# Altium schematic sheet Sensors.SchDoc: Sensors
size 431 x 279 mm; Date: 06/01/2025; ApprovedBy: John Watson; CheckedBy: John Watson; Author: Mehdi Kacem; DrawnBy: Mehdi Kacem; Engineer: Mehdi Kacem; DocumentNumber: BMC-125-5321; Revision: A; SheetNumber: 2; SheetTotal: 6
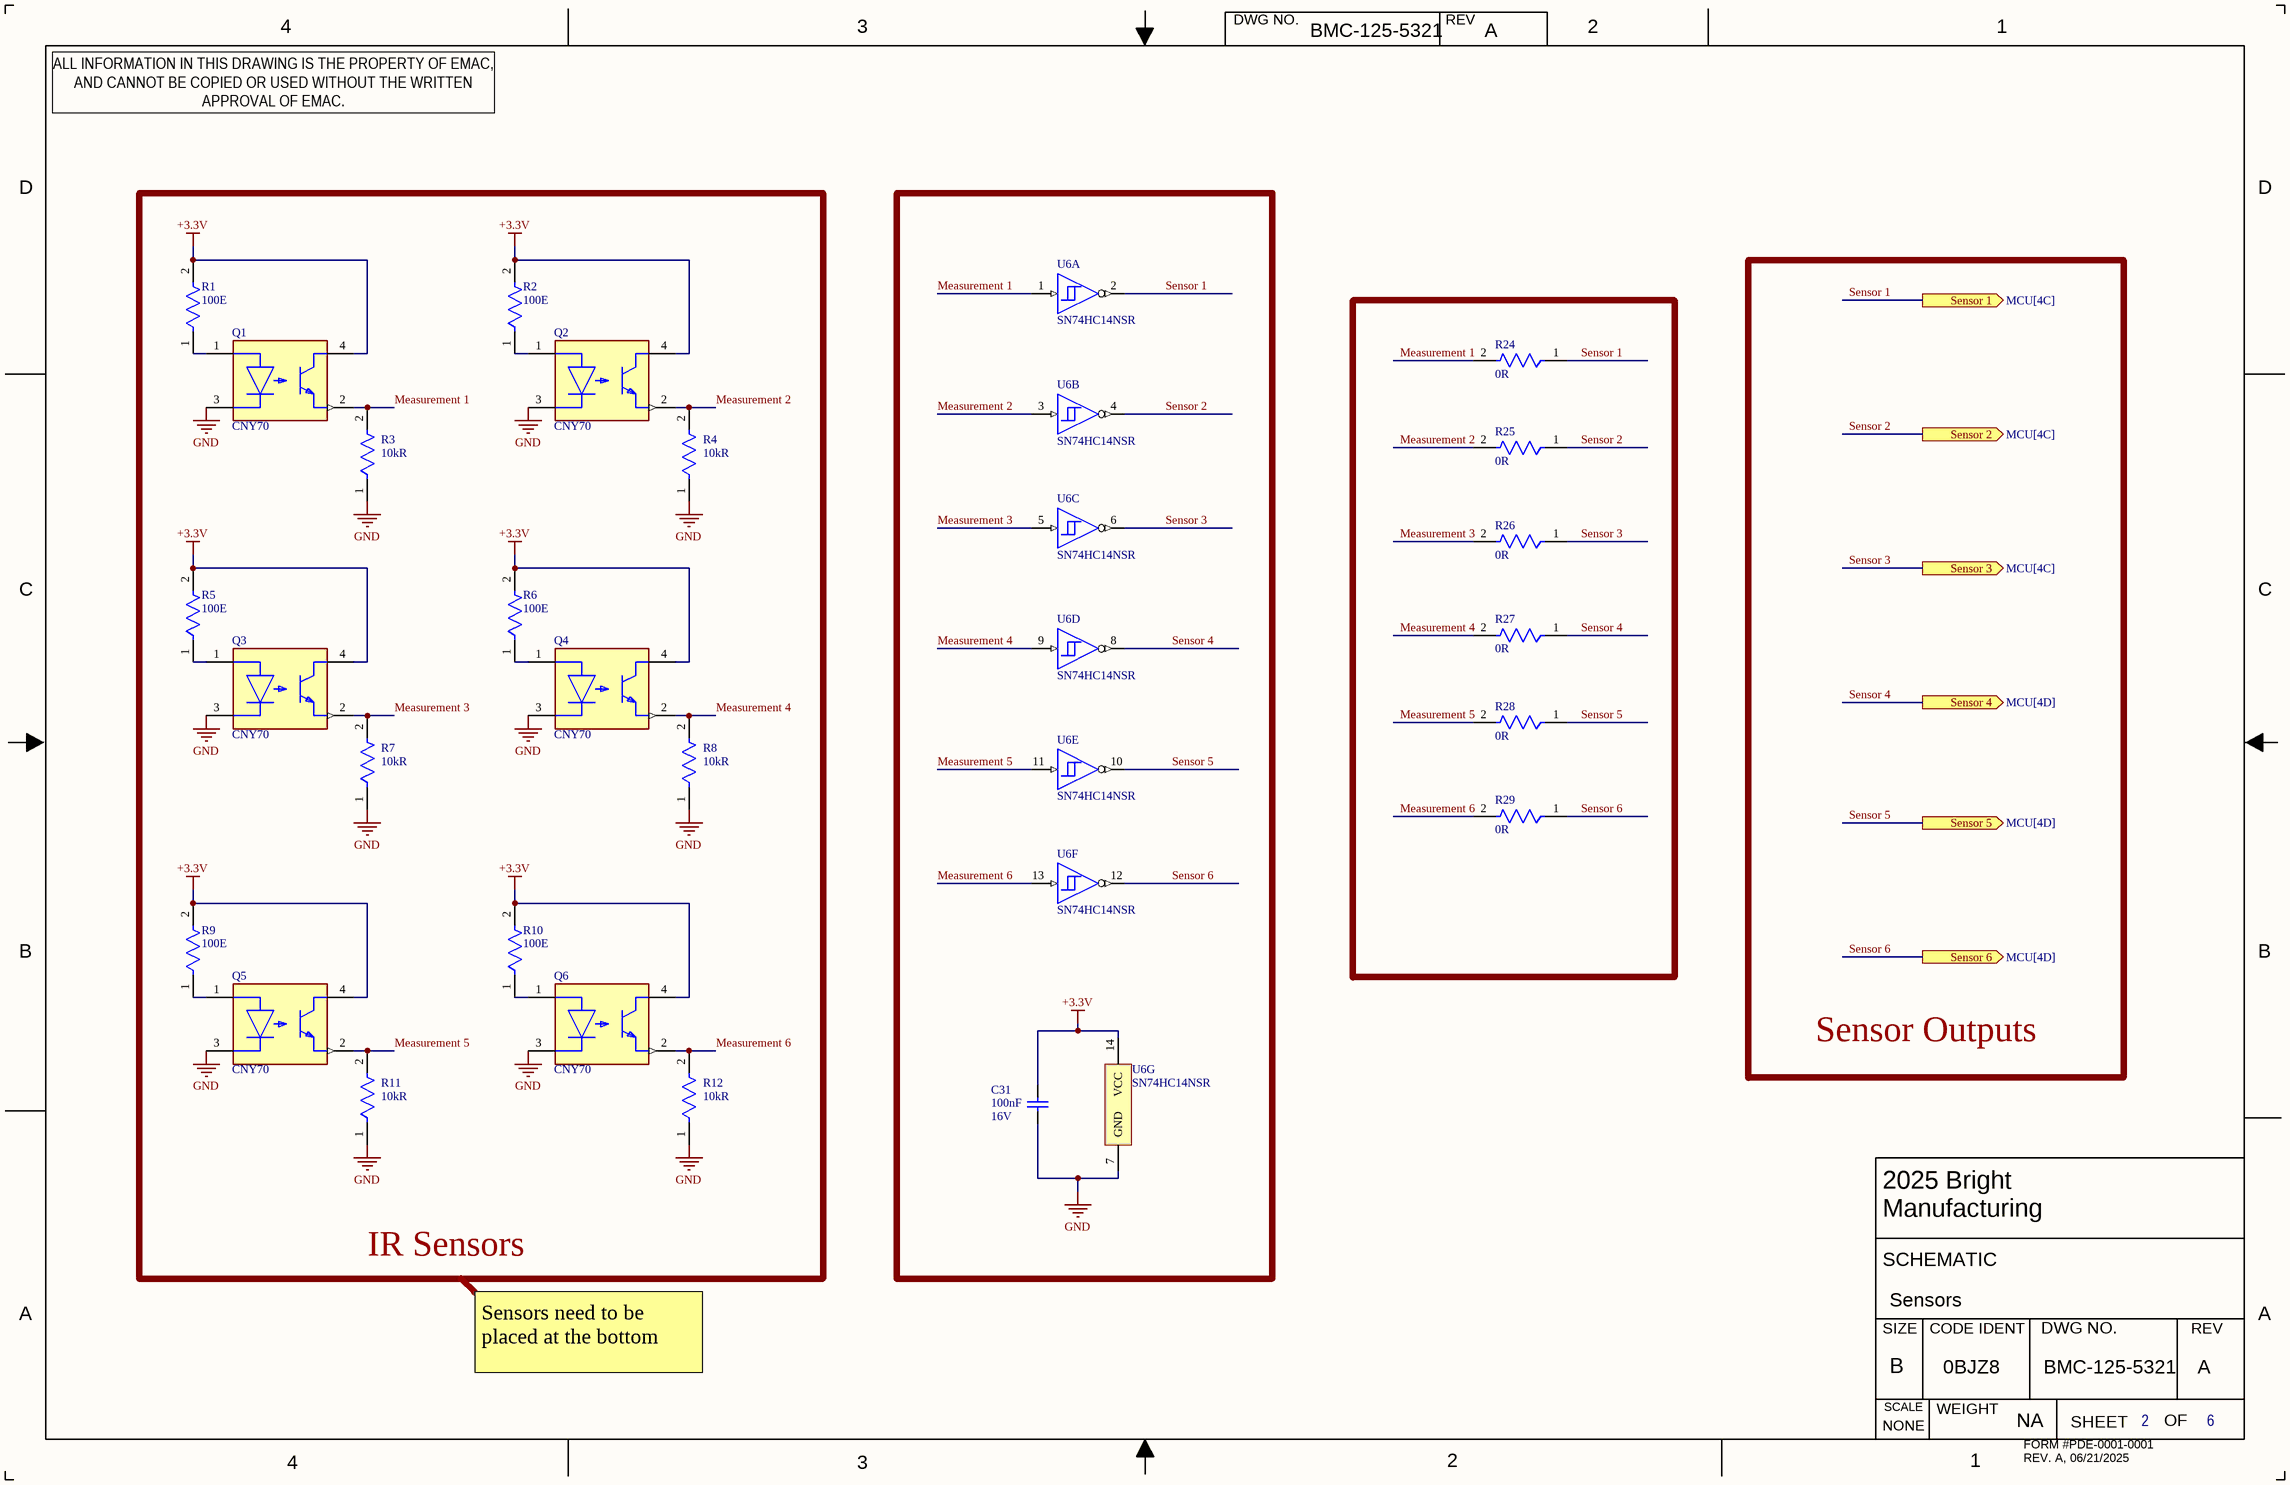
[diagram p0: Sensors.SchDoc]

## Parts
C31  value 100nF  Rated DC Voltage (URdc): 16V  [CAPC1608X90X35LL15T15]  (hidden comment: 0.1uF 16V 0603)
Q1  CNY70  [FP-6_544-5062_01-4-MFG]
Q2  CNY70  [FP-6_544-5062_01-4-MFG]
Q3  CNY70  [FP-6_544-5062_01-4-MFG]
Q4  CNY70  [FP-6_544-5062_01-4-MFG]
Q5  CNY70  [FP-6_544-5062_01-4-MFG]
Q6  CNY70  [FP-6_544-5062_01-4-MFG]
R1  100E  [FP-RT0603-MFG]
R2  100E  [FP-RT0603-MFG]
R3  value 10kR  [RESC1608X55X25ML10T15]  (hidden comment: 10KOhm 0603)
R4  value 10kR  [RESC1608X55X25ML10T15]  (hidden comment: 10KOhm 0603)
R5  100E  [FP-RT0603-MFG]
R6  100E  [FP-RT0603-MFG]
R7  value 10kR  [RESC1608X55X25ML10T15]  (hidden comment: 10KOhm 0603)
R8  value 10kR  [RESC1608X55X25ML10T15]  (hidden comment: 10KOhm 0603)
R9  100E  [FP-RT0603-MFG]
R10  100E  [FP-RT0603-MFG]
R11  value 10kR  [RESC1608X55X25ML10T15]  (hidden comment: 10KOhm 0603)
R12  value 10kR  [RESC1608X55X25ML10T15]  (hidden comment: 10KOhm 0603)
R24  0R  [FP-RC0603-MFG]
R25  0R  [FP-RC0603-MFG]
R26  0R  [FP-RC0603-MFG]
R27  0R  [FP-RC0603-MFG]
R28  0R  [FP-RC0603-MFG]
R29  0R  [FP-RC0603-MFG]
U6  SN74HC14NSR  [NS0014A_N]  (parts A,B,C,D,E,F,G of 7)

## Blocks framed on the sheet
IR Sensors: Q1-Q6 R1-R12

## Ports
Sensor 1 (out, see MCU[4C]), Sensor 2 (out, see MCU[4C]), Sensor 3 (out, see MCU[4C]), Sensor 4 (out, see MCU[4D]), Sensor 5 (out, see MCU[4D]), Sensor 6 (out, see MCU[4D])

## Nets
+3.3V: C31.2 Q1.4(C) Q2.4(C) Q3.4(C) Q4.4(C) Q5.4(C) Q6.4(C) R1.2 R2.2 R5.2 R6.2 R9.2 R10.2 U6.14(VCC)
GND: C31.1 Q1.3(C) Q2.3(C) Q3.3(C) Q4.3(C) Q5.3(C) Q6.3(C) R3.1 R4.1 R7.1 R8.1 R11.1 R12.1 U6.7(GND)
Measurement 1: Q1.2(E) R3.2 R24.2 U6.1(1A)
Measurement 2: Q2.2(E) R4.2 R25.2 U6.3(2A)
Measurement 3: Q3.2(E) R7.2 R26.2 U6.5(3A)
Measurement 4: Q4.2(E) R8.2 R27.2 U6.9(4A)
Measurement 5: Q5.2(E) R11.2 R28.2 U6.11(5A)
Measurement 6: Q6.2(E) R12.2 R29.2 U6.13(6A)
Sensor 1: R24.1 U6.2(~{1Y}) ; port Sensor 1
Sensor 2: R25.1 U6.4(~{2Y}) ; port Sensor 2
Sensor 3: R26.1 U6.6(~{3Y}) ; port Sensor 3
Sensor 4: R27.1 U6.8(~{4Y}) ; port Sensor 4
Sensor 5: R28.1 U6.10(~{5Y}) ; port Sensor 5
Sensor 6: R29.1 U6.12(~{6Y}) ; port Sensor 6
NetQ1_1: Q1.1(A) R1.1
NetQ2_1: Q2.1(A) R2.1
NetQ3_1: Q3.1(A) R5.1
NetQ4_1: Q4.1(A) R6.1
NetQ5_1: Q5.1(A) R9.1
NetQ6_1: Q6.1(A) R10.1

## Notes on the sheet
- Sensor Outputs
- Sensors need to be placed at the bottom
- 4
- 3
- DWG NO.
- REV
- 2
- 1
- ALL INFORMATION IN THIS DRAWING IS THE PROPERTY OF EMAC, AND CANNOT BE COPIED OR USED WITHOUT THE WRITTEN APPROVAL OF EMAC.
- D
- C
- B
- 2025 Bright Manufacturing Challenge
- SCHEMATIC
- A
- SIZE
- CODE IDENT
- 0BJZ8
- NONE
- SCALE
- WEIGHT
- NA
- SHEET
- OF
- REV. A, 06/21/2025
- FORM #PDE-0001-0001

## Library data of the parts
C31 = CMP-00000-2: Ceramic Capacitor, Multilayer, Ceramic, 16V, 10% +Tol, 10% -Tol, X7R, 15% TC, 0.1uF, Surface Mount, 0603; Multilayer: Yes; Reference Standard: AEC-Q200; Height: 0.9mm; Capacitor Type: Ceramic; Case/Package: 0603; Dielectric Material: Ceramic; JESD-609 Code: e3; Length: 1.6mm; Max Operating Temperature: 125°C; Min Operating Temperature: -55°C; Mounting Technology: Surface Mount; Package Shape: Rectangular; Package Style: SMTMeter; Packaging: Tape and Reel; Pins: 2; Reach SVHC Compliant: Yes; RoHS Compliant: Yes; Temperature Characteristics Code: X7R; Terminal Finish: Nickel; Termination: Wraparound; Tolerance  (fill in as +-): 10%; Tolerance (fill in as +-): 10%; Width: 0.81mm
Q1-Q6 = CMP-00014-1: Diffuse Photoelectric Sensor, 0mm Min, 5mm Max, 0.30-1mA, 1-Channel, Square, Through Hole Mount; Body Breadth: 7mm; Body Height: 6mm; Gap Size: 7.6mm; Max Output Voltage: 32V; Max Supply Voltage: 1.6V; Min Supply Voltage: 1.25V; Number of Channels: 1; Operating Current-Max: 50mA; Output Circuit Type: TRANSISTOR; Output Type: Analog Current; Sensor Type: LINEAR POSITION SENSOR,PHOTOELECTRIC,DIFFUSE; VCEsat-Max: 300mV; Body Length or Diameter: 7mm; Max Operating Temperature: 85°C; Measurement Range-Max (mm): 5mm; Measurement Range-Min (mm): 0mm; Min Operating Temperature: -40°C; Mounting Technology: Through Hole; Output Range: 0.30-1mA; Package Shape/Style: Square; Reach SVHC Compliant: Yes; RoHS Compliant: Yes; Termination: Solder
R1 R2 R5 R6 R9 R10 = CMP-2000-04607-2: RES SMD 100 OHM 0.5% 1/10W 0603; Manufacturer Part Number: RT0603DRE07100RL; Manufacturer: Yageo; Voltage Rating: 75V; Power Rating: 0.1W; Tolerance: 0.005; Value: 100Ω; Temperature Coefficient: 50 ppm/°C; ComponentLink2URL: http://www.yageo.com/documents/recent/PYu-RT_1-to-0.01_RoHS_L_9.pdf; ComponentLink2Description: Datasheet; Composition: Thin Film; Temperature Range High: +155°C; Height: 0.55mm; RoHS: TRUE; Octopart: https://octopart.com/rt0603dre07100rl-yageo-1441481; Temperature: -55°C to +155°C; Temperature Range Low: -55°C; Digikey Description: RES SMD 100 OHM 0.5% 1/10W 0603; Ipc Land Pattern Name: RESC16080X45; Device Class L1: Passive Components; Automotive: No; Lead Free: Yes; Device Class L2: Resistors; Package: RT0603; Category: Res; Footprint Url: http://www.yageo.com/exep/pages/download/literatures/PYu-R_Mount_10.pdf; Resistance: 100Ω; Device Class L3: Chip SMD Resistors; Series: RT
R3 R4 R7 R8 R11 R12 = CMP-00018-1: Fixed Resistor, Metal Glaze/thick Film, 0.1W, 10000ohm, 75V, 5% +/-Tol, 100ppm/Cel, Surface Mount, 0603; Additional Feature: LASER TRIMMABLE; Package Height: 0.45mm; Package Length: 1.6mm; Package Width: 0.8mm; Power: 100mW; Rated Temperature: 70°C; Temperature Coefficient (ppm/Cel): 100; Packaging: Tape and Reel; Tolerance: 5%; Case/Package: 0603; Construction: Chip; JESD-609 Code: e3; Max Operating Temperature: 155°C; Min Operating Temperature: -55°C; Mounting Technology: Surface Mount; Package Shape: Rectangular; Pins: 2; Reach SVHC Compliant: Yes; Resistor Type: FIXED RESISTOR; RoHS Compliant: Yes; Technology: METAL GLAZE/THICK FILM; Terminal Finish: Nickel; Termination: Wraparound; Working Voltage: 75V
R24-R29 = CMP-2000-06925-2: RES SMD 0 OHM JUMPER 1/10W 0603; Manufacturer: Yageo; Manufacturer Part Number: RC0603FR-070RL; Tolerance: 1%; Value: 0Ω; Power Rating: 0.1W; Voltage Rating: 75V; Composition: Thick Film; Temperature Range Low: -55°C; Ipc Land Pattern Name: RESC16080X45; Lead Free: Yes; Digikey Description: RES SMD 0 OHM JUMPER 1/10W 0603; Height: 0.55mm; Automotive: No; Device Class L3: Chip SMD Resistors; Device Class L1: Passive Components; Device Class L2: Resistors; Footprint Url: http://www.yageo.com/exep/pages/download/literatures/PYu-R_Mount_10.pdf; Category: Res; Mouser Description: RC Series 0603 0.1 W 0 O Jumper Surface Mount Thick Film Chip Resistor; Resistance: 0Ω; ComponentLink2URL: http://www.yageo.com/documents/recent/PYu-RC_Group_51_RoHS_L_10.pdf; Series: RC_L; ComponentLink2Description: Datasheet; RoHS: TRUE; Temperature: -55°C to +155°C; Temperature Range High: +155°C; Package: RC0603; Octopart: https://octopart.com/rc0603fr-070rl-yageo-1180803
U6 = CMP-00021-8: Inverter, HC Series, 6-Func, 1-Input, CMOS, PDSO14; Propagation Delay (tpd): 155ns; Package Body Material: Plastic; Package Equivalence Code: SOP14,.3; Nominal Supply Voltage: 5V; Schmitt Trigger: Yes; Channels: 6; Min Supply Voltage: 2V; Load Capacitance (CL): 50pF; Prop. Delay@Nom-Sup: 31ns; Qualification Status: Not Qualified; Max Supply Voltage: 6V; Max I(ol): 4mA; Power Supplies: 2/6V; Number of Inputs: 1; JESD-30 Code: R-PDSO-G14; Pins: 14; Moisture Sensitivity Level: 1; Terminal Finish: Nickel; Terminal Pitch: 1.27mm; Height - Seated (Max): 2mm; JESD-609 Code: e4; RoHS Compliant: Yes; Terminal Position: DUAL; Logic Type: INVERTER; Length: 10.2mm; Max Operating Temperature: 85°C; Package Style: SMALL OUTLINEMeter; Technology: CMOS; Reach SVHC Compliant: Yes; Case/Package: SOP; Package Shape: Rectangular; Width: 5.3mm; Min Operating Temperature: -40°C; Load/Preset Input: Yes; Peak Reflow Temperature (Cel): 260°C; Surface Mount: Yes; Terminal Form: Gull Wing; Packaging: Tape and Reel; Temperature Grade: INDUSTRIAL